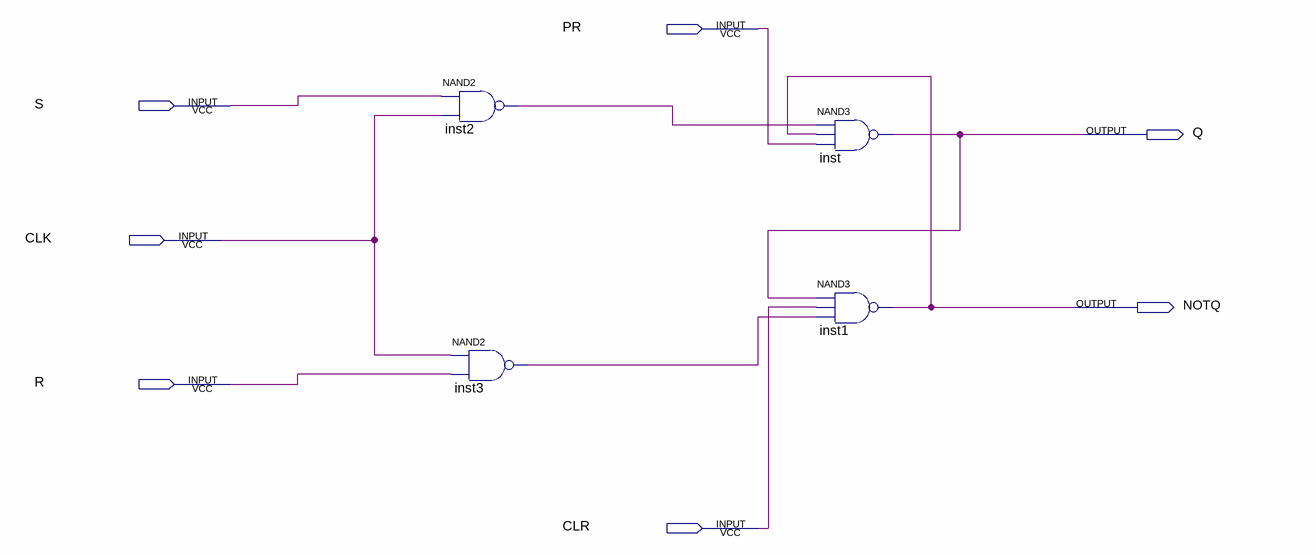
[diagram p0: schematic sheet]
// Quartus schematic SRFF.bdf as structural Verilog: 4 symbols, 7 pins
module SRFF (
  input  PR,
  input  S,
  input  CLK,
  input  R,
  input  CLR,
  output Q,
  output NOTQ
);

  wire inst2_out, inst3_out;

  nand inst2 (inst2_out, S, CLK);
  nand inst3 (inst3_out, CLK, R);
  nand inst (Q, inst2_out, NOTQ, PR);
  nand inst1 (NOTQ, Q, CLR, inst3_out);
endmodule
